# Altium schematic sheet Power.SchDoc
size A4
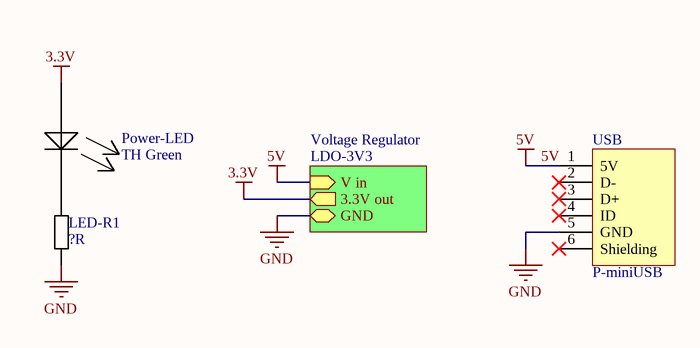
[diagram p0: Power.SchDoc]

## Parts
LED-R1  ?R  [R 0805 / 2012]
Power-LED  TH Green  [LED 3mm]
USB  P-miniUSB  [miniUSB]

## Sub-sheets
Voltage Regulator = LDO-3V3: 3.3V out (out), GND, V in (in)

## Nets
3.3V: Power-LED.1(+) ; sheet Voltage Regulator/3.3V out
5V: USB.1(5V) ; sheet Voltage Regulator/V in
GND: LED-R1.1 USB.5(GND) ; sheet Voltage Regulator/GND
NetLED-R1_2: LED-R1.2 Power-LED.2(-)

Not connected (* = marked no-connect by the designer): USB 2(D-)* 3(D+)* 4(ID)* 6(Shielding)*

## Library data of the parts
LED-R1 = Resistor
Power-LED = LED
USB = miniUSB